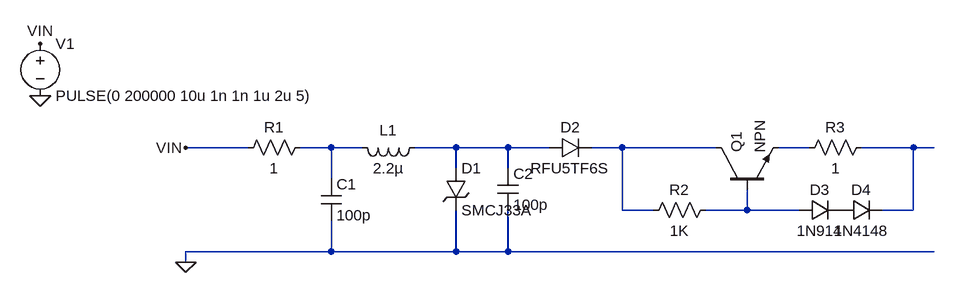
[diagram p0: schematic SCU_CONN_J1.asc]
SCU_CONN_J1.asc, the LTspice schematic file:
Version 4
SHEET 1 1124 680
WIRE 64 128 -32 128
WIRE 192 128 144 128
WIRE 240 128 192 128
WIRE 384 128 320 128
WIRE 464 128 384 128
WIRE 528 128 464 128
WIRE 640 128 592 128
WIRE 784 128 640 128
WIRE 928 128 880 128
WIRE 1088 128 1008 128
WIRE 1120 128 1088 128
WIRE 384 160 384 128
WIRE 464 160 464 128
WIRE 192 176 192 128
WIRE 640 224 640 128
WIRE 688 224 640 224
WIRE 832 224 832 192
WIRE 832 224 768 224
WIRE 912 224 832 224
WIRE 1088 224 1088 128
WIRE 1088 224 1040 224
WIRE 192 288 192 240
WIRE 192 288 -32 288
WIRE 384 288 384 224
WIRE 384 288 192 288
WIRE 464 288 464 224
WIRE 464 288 384 288
WIRE 1120 288 464 288
WIRE -32 304 -32 288
FLAG -32 304 0
FLAG -32 128 VIN
FLAG -256 48 0
FLAG -256 -32 VIN
SYMBOL res 160 112 R90
WINDOW 0 0 56 VBottom 2
WINDOW 3 32 56 VTop 2
SYMATTR InstName R1
SYMATTR Value 1
SYMATTR SpiceLine tol=1 pwr=0.1
SYMBOL cap 176 176 R0
SYMATTR InstName C1
SYMATTR Value 100p
SYMATTR SpiceLine V=1000 Irms=20.8m Rser=5.448 Lser=0
SYMBOL ind 336 112 R90
WINDOW 0 5 56 VBottom 2
WINDOW 3 32 56 VTop 2
SYMATTR InstName L1
SYMATTR Value 2.2µ
SYMATTR SpiceLine Ipk=0.38 Rser=0.7 Rpar=7856 Cpar=343f mfg="Wurth Elektronik" pn="74476602 WE-GF 1812"
SYMBOL TVSdiode 368 160 R0
SYMATTR InstName D1
SYMATTR Value SMCJ33A
SYMBOL cap 448 160 R0
SYMATTR InstName C2
SYMATTR Value 100p
SYMATTR SpiceLine V=1000 Irms=20.8m Rser=5.448 Lser=0
SYMBOL diode 528 144 R270
WINDOW 0 32 32 VTop 2
WINDOW 3 0 32 VBottom 2
SYMATTR InstName D2
SYMATTR Value RFU5TF6S
SYMBOL res 784 208 R90
WINDOW 0 0 56 VBottom 2
WINDOW 3 32 56 VTop 2
SYMATTR InstName R2
SYMATTR Value 1K
SYMATTR SpiceLine tol=1 pwr=0.1
SYMBOL diode 912 240 R270
WINDOW 0 32 32 VTop 2
WINDOW 3 0 32 VBottom 2
SYMATTR InstName D3
SYMATTR Value 1N914
SYMBOL diode 976 240 R270
WINDOW 0 32 32 VTop 2
WINDOW 3 0 32 VBottom 2
SYMATTR InstName D4
SYMATTR Value 1N4148
SYMBOL res 1024 112 R90
WINDOW 0 0 56 VBottom 2
WINDOW 3 32 56 VTop 2
SYMATTR InstName R3
SYMATTR Value 1
SYMATTR SpiceLine tol=1 pwr=0.1
SYMBOL npn 784 192 R270
SYMATTR InstName Q1
SYMBOL voltage -256 -48 R0
WINDOW 123 0 0 Left 2
WINDOW 39 0 0 Left 2
SYMATTR InstName V1
SYMATTR Value PULSE(0 200000 10u 1n 1n 1u 2u 5)

The netlist it stands for:
* SCU_CONN_J1.asc
R1 N001 VIN 1 tol=1 pwr=0.1
C1 N001 0 100p V=1000 Irms=20.8m Rser=5.448 Lser=0
L1 N002 N001 2.2µ Ipk=0.38 Rser=0.7 Rpar=7856 Cpar=343f mfg="Wurth Elektronik" pn="74476602 WE-GF 1812"
D1 N002 0 SMCJ33A
C2 N002 0 100p V=1000 Irms=20.8m Rser=5.448 Lser=0
D2 N002 N003 RFU5TF6S
R2 N006 N003 1K tol=1 pwr=0.1
D3 N006 P001 1N914
D4 P001 N005 1N4148
R3 N005 N004 1 tol=1 pwr=0.1
Q1 N003 N006 N004 0 NPN
V1 VIN 0 PULSE(0 200000 10u 1n 1n 1u 2u 5)
.model D D
.lib standard.dio
.model NPN NPN
.model PNP PNP
.lib standard.bjt
.backanno
.end